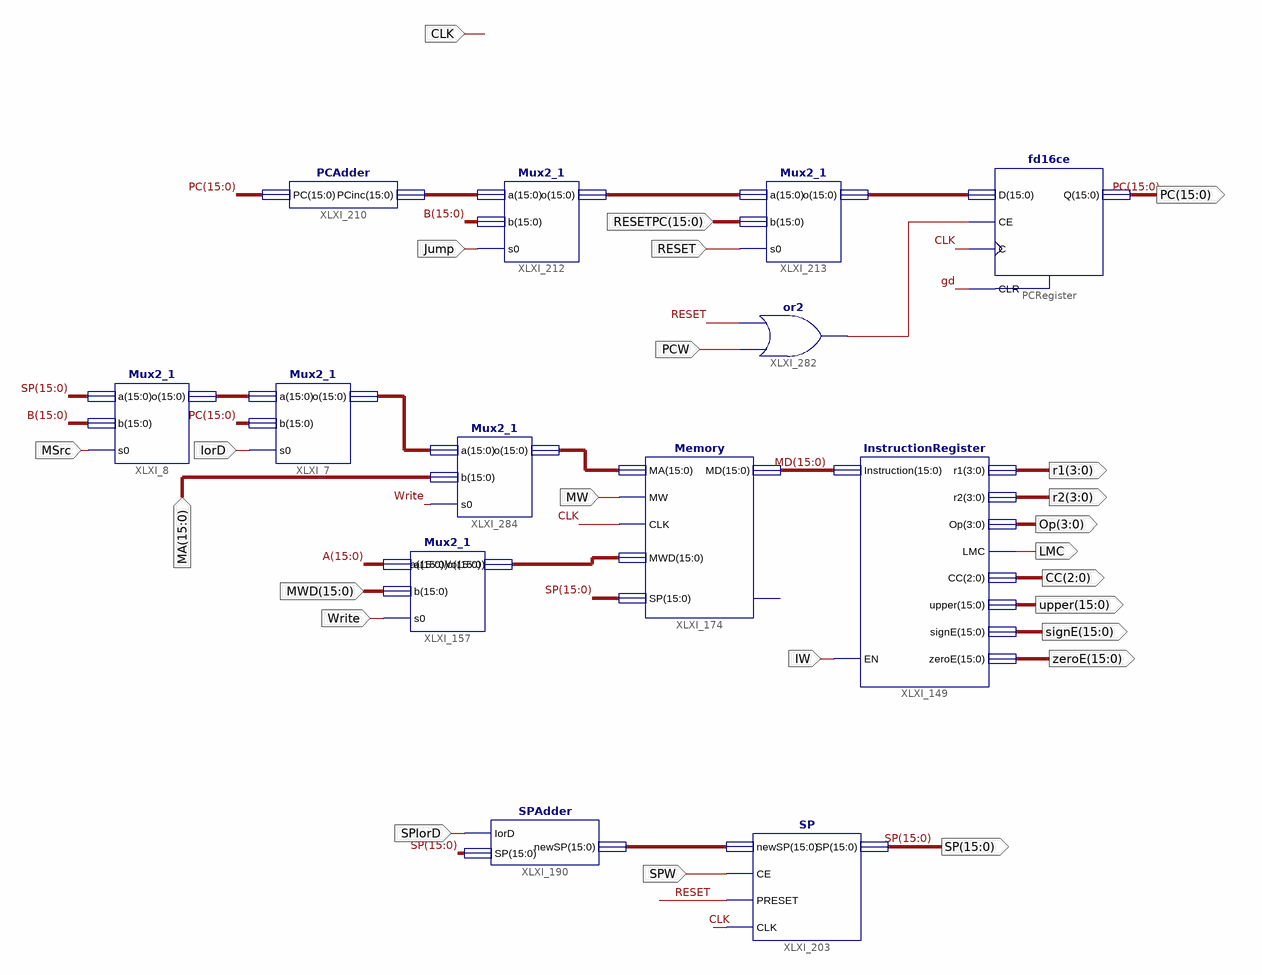
[diagram p0: schematic sheet 1]
// Xilinx ISE schematic IntegratedTestPCMemIRSp.sch (spartan3e) as structural Verilog: 13 symbols, 24 ports
module IntegratedTestPCMemIRSp (
  input  CLK,
  input  Jump,
  input  [15:0] RESETPC,
  input  RESET,
  input  PCW,
  input  MW,
  input  SPW,
  input  SPIorD,
  input  MSrc,
  input  IorD,
  input  [15:0] MA,
  input  [15:0] MWD,
  input  Write,
  input  IW,
  output [15:0] PC,
  output [3:0] Op,
  output [15:0] upper,
  output [15:0] signE,
  output LMC,
  output [2:0] CC,
  output [15:0] SP,
  output [3:0] r1,
  output [3:0] r2,
  output [15:0] zeroE
);

  wire gd, XLXN_792;
  wire [15:0] A, B, MD, XLXN_11, XLXN_43, XLXN_175, XLXN_667, XLXN_781, XLXN_828, XLXN_829;

  fd16ce PCRegister (
    .C(CLK), .CE(XLXN_792), .CLR(gd),
    .D({XLXN_175[0], XLXN_175[1], XLXN_175[2], XLXN_175[3], XLXN_175[4], XLXN_175[5], XLXN_175[6], XLXN_175[7], XLXN_175[8], XLXN_175[9], XLXN_175[10], XLXN_175[11], XLXN_175[12], XLXN_175[13], XLXN_175[14], XLXN_175[15]}),
    .Q(PC));
  PCAdder XLXI_210 (.PC(PC), .PCinc(XLXN_667));
  Mux2_1 XLXI_212 (.a(XLXN_667), .b(B), .s0(Jump), .o(XLXN_781));
  Mux2_1 XLXI_213 (
    .a(XLXN_781), .b(RESETPC), .s0(RESET),
    .o({XLXN_175[0], XLXN_175[1], XLXN_175[2], XLXN_175[3], XLXN_175[4], XLXN_175[5], XLXN_175[6], XLXN_175[7], XLXN_175[8], XLXN_175[9], XLXN_175[10], XLXN_175[11], XLXN_175[12], XLXN_175[13], XLXN_175[14], XLXN_175[15]}));
  or XLXI_282 (XLXN_792, PCW, RESET);
  InstructionRegister XLXI_149 (
    .Instruction(MD), .LMC(LMC), .r1(r1), .r2(r2), .Op(Op), .CC(CC), .signE(signE), .upper(upper), .EN(IW),
    .zeroE(zeroE));
  SP XLXI_203 (.SP(SP), .CE(SPW), .PRESET(RESET), .CLK(CLK), .newSP(XLXN_43));
  SPAdder XLXI_190 (.IorD(SPIorD), .SP(SP), .newSP(XLXN_43));
  Mux2_1 XLXI_157 (.a(A), .b(MWD), .s0(Write), .o(A));
  Mux2_1 XLXI_284 (.a(XLXN_828), .b(MA), .s0(Write), .o(XLXN_829));
  Mux2_1 XLXI_8 (
    .a(SP), .b(B), .s0(MSrc),
    .o({XLXN_11[0], XLXN_11[1], XLXN_11[2], XLXN_11[3], XLXN_11[4], XLXN_11[5], XLXN_11[6], XLXN_11[7], XLXN_11[8], XLXN_11[9], XLXN_11[10], XLXN_11[11], XLXN_11[12], XLXN_11[13], XLXN_11[14], XLXN_11[15]}));
  Mux2_1 XLXI_7 (
    .a({XLXN_11[0], XLXN_11[1], XLXN_11[2], XLXN_11[3], XLXN_11[4], XLXN_11[5], XLXN_11[6], XLXN_11[7], XLXN_11[8], XLXN_11[9], XLXN_11[10], XLXN_11[11], XLXN_11[12], XLXN_11[13], XLXN_11[14], XLXN_11[15]}),
    .b(PC), .s0(IorD), .o(XLXN_828));
  Memory XLXI_174 (.MA(XLXN_829), .MW(MW), .MD(MD), .CLK(CLK), .MWD(A), .SP(SP));  // open: segFault
endmodule
